# Altium schematic sheet Copy of CortexM3_dev.SchDoc: Cortex M3 Dev and Memory
size A4; DrawnBy: Watzek; Organization: HTL Hollabrunn; Address1: Abteilung Elektronik; Address2: Anton Ehrenfried-Straße 10; Address3: 2020 Hollabrunn; DocumentNumber: 06; Revision: 01; SheetNumber: 06; SheetTotal: 06; SPICEModelCacheGTJPSRCJ: <root> / <DocumentId>GTJPSRCJ</DocumentId> / <CacheFrame Number="0"> / <Model Name="led0" Kind="MDL"> / <Text>*Typ INFRARED GaAs LED: Vf=1.2V Vr=5V If=40mA trr=3uS / *LED Pinout: 1=A, 2=K / .MODEL LED0 D (IS=93.5P RS=84M N=2.63 BV=5 IBV=10U / + CJO=2.97P VJ=.75 M=.333 TT=4.32U)</Text> / </Model> / <Model Name="cap" Kind="MDL"> / <Text>*Default semiconductor capacitor / .MODEL CAP C()</Text> / </Model> / </CacheFrame> / </root>
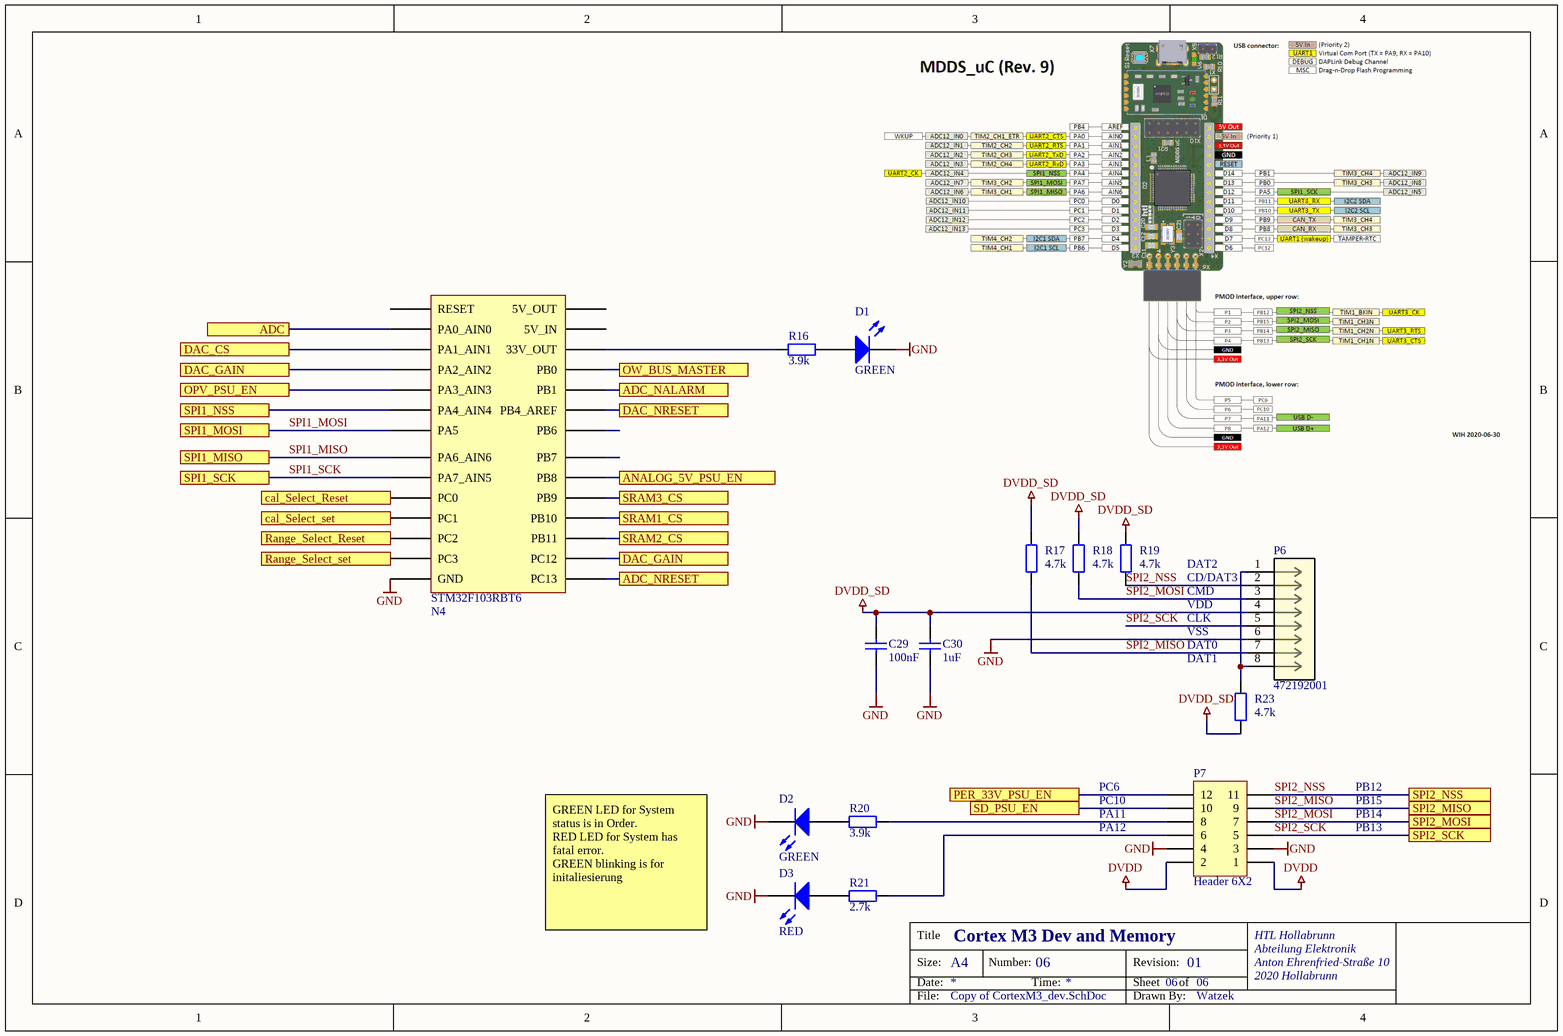
[diagram p0: Copy of CortexM3_dev.SchDoc]

## Parts
C29  100nF  [C1206-KUE]
C30  1uF  [C1206-KUE]
D1  GREEN  [6-0805_N-KUE]
D2  GREEN  [6-0805_N-KUE]
D3  RED  [6-0805_N-KUE]
N4  STM32F103  [DIP28]  (value not drawn)
P6  472192001  [CONN_47219-2001_MOL]
P7  Header 6X2  [HDR2X6]
R16  3.9k  [C1206-KUE]
R17  4.7k  [C1206-KUE]
R18  4.7k  [C1206-KUE]
R19  4.7k  [C1206-KUE]
R20  3.9k  [C1206-KUE]
R21  2.7k  [C1206-KUE]
R23  4.7k  [C1206-KUE]

## Ports
ADC, ADC_NALARM, ADC_NRESET, ANALOG_5V_PSU_EN, cal_Select_Reset, cal_Select_set, DAC_CS, DAC_GAIN, DAC_NRESET, OPV_PSU_EN, OW_BUS_MASTER, PER_33V_PSU_EN, Range_Select_Reset, Range_Select_set, SD_PSU_EN, SPI1_MISO, SPI1_MOSI, SPI1_NSS, SPI1_SCK, SPI2_MISO, SPI2_MOSI, SPI2_NSS, SPI2_SCK, SRAM1_CS, SRAM2_CS, SRAM3_CS

## Nets
DVDD: P7.1 P7.2
DVDD_SD: C29.2 C30.2 P6.4 R17.1 R18.1 R19.1 R23.2
GND: C29.1 C30.1 D1.2(K) D2.2(K) D3.2(K) N4.18(GND) P6.6 P7.3 P7.4
ADC: N4.2(PA0_AIN0) ; port ADC
ADC_NALARM: N4.20(PB1) ; port ADC_NALARM
ADC_NRESET: N4.27(PC13) ; port ADC_NRESET
ANALOG_5V_PSU_EN: N4.26(PB8) ; port ANALOG_5V_PSU_EN
cal_Select_Reset: N4.9(PC0) ; port cal_Select_Reset
cal_Select_set: N4.10(PC1) ; port cal_Select_set
DAC_CS: N4.3(PA1_AIN1) ; port DAC_CS
DAC_GAIN: N4.4(PA2_AIN2) N4.28(PC12) ; port DAC_GAIN
DAC_NRESET: N4.1(PB4_AREF) ; port DAC_NRESET
OPV_PSU_EN: N4.5(PA3_AIN3) ; port OPV_PSU_EN
OW_BUS_MASTER: N4.21(PB0) ; port OW_BUS_MASTER
PER_33V_PSU_EN: P7.12 ; port PER_33V_PSU_EN
Range_Select_Reset: N4.11(PC2) ; port Range_Select_Reset
Range_Select_set: N4.12(PC3) ; port Range_Select_set
SD_PSU_EN: P7.10 ; port SD_PSU_EN
SPI1_MISO: N4.8(PA6_AIN6) ; port SPI1_MISO
SPI1_MOSI: N4.22(PA5) ; port SPI1_MOSI
SPI1_NSS: N4.6(PA4_AIN4) ; port SPI1_NSS
SPI1_SCK: N4.7(PA7_AIN5) ; port SPI1_SCK
SPI2_MISO: P6.7 P7.9 R17.2 ; port SPI2_MISO
SPI2_MOSI: P6.3 P7.7 R18.2 ; port SPI2_MOSI
SPI2_NSS: P6.2 P7.11 R19.2 ; port SPI2_NSS
SPI2_SCK: P6.5 P7.5 ; port SPI2_SCK
SRAM1_CS: N4.24(PB10) ; port SRAM1_CS
SRAM2_CS: N4.23(PB11) ; port SRAM2_CS
SRAM3_CS: N4.25(PB9) ; port SRAM3_CS
NetD1_1: D1.1(A) R16.2
NetD2_1: D2.1(A) R20.2
NetD3_1: D3.1(A) R21.2
NetN4_17: N4.17(33V_OUT) R16.1
NetP6_1: P6.1 P6.8 R23.1
NetP7_6: P7.6 R21.1
NetP7_8: P7.8 R20.1

Not connected (* = marked no-connect by the designer): N4 13(PB7) 14(PB6) 15(5V_OUT) 16(5V_IN) 19(RESET)

## Notes on the sheet
- DAT2
- CD/DAT3
- CMD
- VDD
- CLK
- VSS
- DAT0
- DAT1
- PC6
- PB12
- PC10
- PA11
- PA12
- PB15
- PB14
- PB13
- GREEN LED for System status is in Order.
  RED LED for System has fatal error.
  GREEN blinking is for initaliesierung
- Title
- Size:
- Date:
- A4
- Number:
- Time:
- Revision:
- Sheet
- of
- HTL Hollabrunn
- Abteilung Elektronik
- Anton Ehrenfried-Straße 10
- 2020 Hollabrunn
- File:
- Drawn By:
- (in symbol STM32F103) STM32F103RBT6

## Library data of the parts
C29 C30 = Capacitor: Manufacturer: Kemet; Bezeichnung: Kerko +-10% 63V; Published: 8-Jun-2000; LatestRevisionDate: 17-Jul-2002; LatestRevisionNote: Re-released for DXP Platform.; PackageReference: RAD-0.3; Publisher: Altium Limited; PackageDescription: Radial Cap, Thru-Hole; 2 Leads; 0.3 in Pin Spacing; Orderingcode: *
  C29: Value: 100nF
  C30: Value: 1uF
D1-D3 = LED0: Typical INFRARED GaAs LED; Published: 8-Jun-2000; LatestRevisionDate: 08-Jul-2005; LatestRevisionNote: Mech Layer 1 removed.; PackageReference: LED-0; Publisher: Altium Limited; PackageDescription: LED; 2 Leads
P6 = 472192001: 1.10mm Pitch microSD Card Connector, Hinge Type, Lead-Free; Manufacturer_Name: Molex Connector Corporation; Copyright: Copyright (C) 2025 Ultra Librarian. All rights reserved.; Manufacturer_Part_Number: 472192001; RefDes: RefDes; Type: Type
P7 = Header 6X2: Header, 6-Pin, Dual row; LatestRevisionDate: 17-Jul-2002; LatestRevisionNote: Re-released for DXP Platform.; Publisher: Altium Limited
R16-R21 R23 = ResistorSMD: Resistor SMD; Manufacturer: AVX; Bezeichnung: SMD Wid. 1/8W 2%; Published: 8-Jun-2000; LatestRevisionDate: 17-Jul-2002; LatestRevisionNote: Re-released for DXP Platform.; PackageReference: AXIAL-0.4; Publisher: Altium Limited; PackageDescription: Axial Device, Thru-Hole; 2 Leads; 0.4 in Pin Spacing; Orderingcode: *
  R16 R20: Value: 3.9k
  R17-R19 R23: Value: 4.7k
  R21: Value: 2.7k